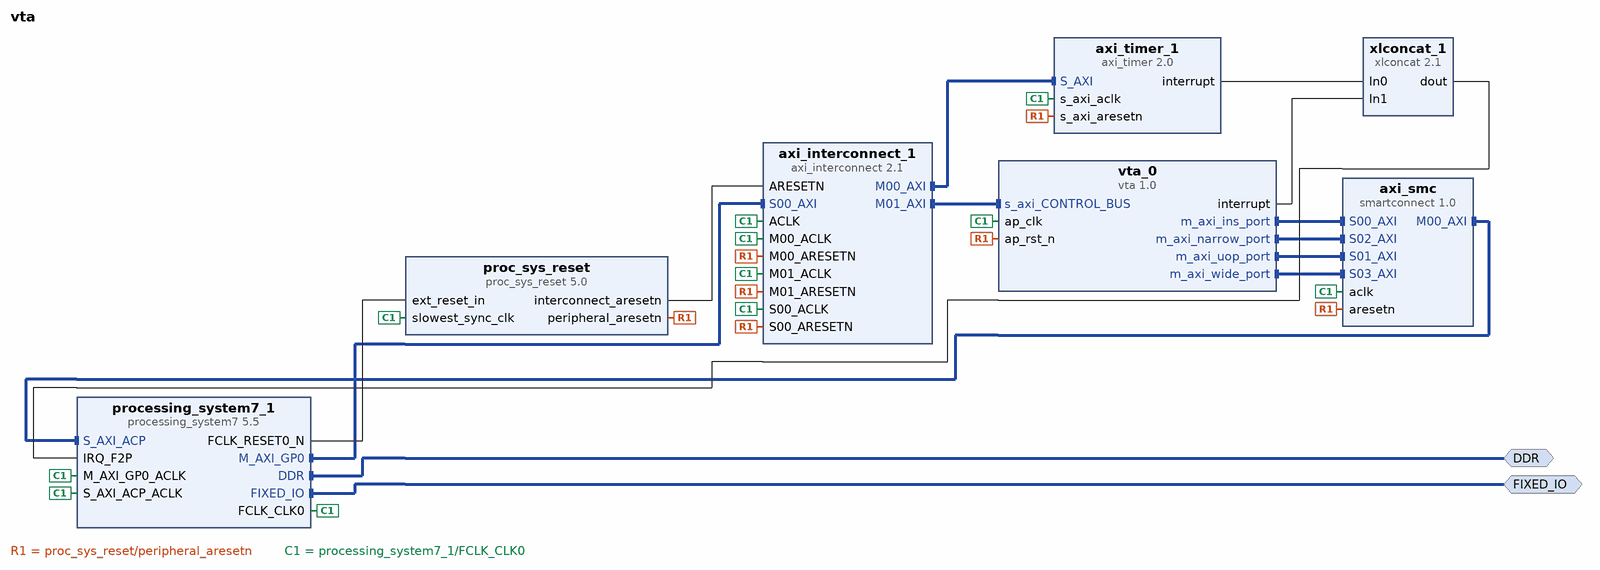
[diagram p0: block diagram of the top level]
# Vivado block design vta, xc7z020clg484-1, Vivado 2017.1
create_bd_design vta

create_bd_intf_port -mode Master -vlnv xilinx.com:interface:ddrx_rtl:1.0 DDR
create_bd_intf_port -mode Master -vlnv xilinx.com:display_processing_system7:fixedio_rtl:1.0 FIXED_IO

create_bd_cell -type ip -vlnv xilinx.com:hls:vta:1.0 vta_0
set_property -dict [list \
  CONFIG.C_M_AXI_INS_PORT_CACHE_VALUE {"1111"} \
  CONFIG.C_M_AXI_UOP_PORT_CACHE_VALUE {"1111"} \
  CONFIG.C_M_AXI_NARROW_PORT_CACHE_VALUE {"1111"} \
  CONFIG.C_M_AXI_WIDE_PORT_CACHE_VALUE {"1111"} \
] [get_bd_cells vta_0]
create_bd_cell -type ip -vlnv xilinx.com:ip:axi_interconnect:2.1 axi_interconnect_1
set_property -dict {CONFIG.NUM_MI 2} [get_bd_cells axi_interconnect_1]
create_bd_cell -type ip -vlnv xilinx.com:ip:smartconnect:1.0 axi_smc
set_property -dict {CONFIG.NUM_SI 4} [get_bd_cells axi_smc]
create_bd_cell -type ip -vlnv xilinx.com:ip:axi_timer:2.0 axi_timer_1
create_bd_cell -type ip -vlnv xilinx.com:ip:proc_sys_reset:5.0 proc_sys_reset
create_bd_cell -type ip -vlnv xilinx.com:ip:processing_system7:5.5 processing_system7_1
set_property -dict [list \
  CONFIG.PCW_FPGA0_PERIPHERAL_FREQMHZ 100 \
  CONFIG.PCW_FPGA1_PERIPHERAL_FREQMHZ 142.86 \
  CONFIG.PCW_FPGA2_PERIPHERAL_FREQMHZ 200 \
  CONFIG.PCW_FPGA3_PERIPHERAL_FREQMHZ 167 \
  CONFIG.PCW_USE_S_AXI_ACP 1 \
  CONFIG.PCW_USE_FABRIC_INTERRUPT 1 \
  CONFIG.PCW_USE_HIGH_OCM 1 \
  CONFIG.PCW_USE_DEFAULT_ACP_USER_VAL 1 \
  CONFIG.PCW_EN_CLK1_PORT 1 \
  CONFIG.PCW_EN_CLK2_PORT 1 \
  CONFIG.PCW_EN_CLK3_PORT 1 \
  CONFIG.PCW_IRQ_F2P_INTR 1 \
  CONFIG.PCW_QSPI_PERIPHERAL_ENABLE 0 \
  CONFIG.PCW_ENET0_PERIPHERAL_ENABLE 0 \
  CONFIG.PCW_SD0_PERIPHERAL_ENABLE 0 \
  CONFIG.PCW_USB0_PERIPHERAL_ENABLE 0 \
  CONFIG.PCW_GPIO_MIO_GPIO_ENABLE 0 \
  CONFIG.preset ZC702 \
] [get_bd_cells processing_system7_1]
# 8 more settings of processing_system7_1 are not shown: defaults, MIO pin electricals, DDR timing, and values the tool derives
create_bd_cell -type ip -vlnv xilinx.com:ip:xlconcat:2.1 xlconcat_1
set_property -dict {CONFIG.NUM_PORTS 2} [get_bd_cells xlconcat_1]

# ---- connections ----

connect_bd_intf_net [get_bd_intf_pins vta_0/m_axi_ins_port] [get_bd_intf_pins axi_smc/S00_AXI]
connect_bd_intf_net [get_bd_intf_pins vta_0/m_axi_narrow_port] [get_bd_intf_pins axi_smc/S02_AXI]
connect_bd_intf_net [get_bd_intf_pins vta_0/m_axi_uop_port] [get_bd_intf_pins axi_smc/S01_AXI]
connect_bd_intf_net [get_bd_intf_pins vta_0/m_axi_wide_port] [get_bd_intf_pins axi_smc/S03_AXI]
connect_bd_intf_net [get_bd_intf_pins vta_0/s_axi_CONTROL_BUS] [get_bd_intf_pins axi_interconnect_1/M01_AXI]
connect_bd_intf_net [get_bd_intf_pins axi_smc/M00_AXI] [get_bd_intf_pins processing_system7_1/S_AXI_ACP]
connect_bd_intf_net [get_bd_intf_pins axi_interconnect_1/M00_AXI] [get_bd_intf_pins axi_timer_1/S_AXI]
connect_bd_intf_net [get_bd_intf_pins axi_interconnect_1/S00_AXI] [get_bd_intf_pins processing_system7_1/M_AXI_GP0]
connect_bd_intf_net [get_bd_intf_ports DDR] [get_bd_intf_pins processing_system7_1/DDR]
connect_bd_intf_net [get_bd_intf_ports FIXED_IO] [get_bd_intf_pins processing_system7_1/FIXED_IO]
connect_bd_net [get_bd_pins vta_0/interrupt] [get_bd_pins xlconcat_1/In1]
connect_bd_net [get_bd_pins axi_timer_1/interrupt] [get_bd_pins xlconcat_1/In0]
connect_bd_net [get_bd_pins proc_sys_reset/interconnect_aresetn] [get_bd_pins axi_interconnect_1/ARESETN]
connect_bd_net [get_bd_pins proc_sys_reset/peripheral_aresetn] \
  [get_bd_pins vta_0/ap_rst_n] [get_bd_pins axi_interconnect_1/M00_ARESETN] [get_bd_pins axi_interconnect_1/M01_ARESETN] \
  [get_bd_pins axi_interconnect_1/S00_ARESETN] [get_bd_pins axi_smc/aresetn] [get_bd_pins axi_timer_1/s_axi_aresetn]
connect_bd_net [get_bd_pins processing_system7_1/FCLK_CLK0] \
  [get_bd_pins vta_0/ap_clk] [get_bd_pins axi_interconnect_1/ACLK] [get_bd_pins axi_interconnect_1/M00_ACLK] \
  [get_bd_pins axi_interconnect_1/M01_ACLK] [get_bd_pins axi_interconnect_1/S00_ACLK] [get_bd_pins axi_smc/aclk] \
  [get_bd_pins axi_timer_1/s_axi_aclk] [get_bd_pins proc_sys_reset/slowest_sync_clk] \
  [get_bd_pins processing_system7_1/M_AXI_GP0_ACLK] [get_bd_pins processing_system7_1/S_AXI_ACP_ACLK]
connect_bd_net [get_bd_pins processing_system7_1/FCLK_RESET0_N] [get_bd_pins proc_sys_reset/ext_reset_in]
connect_bd_net [get_bd_pins xlconcat_1/dout] [get_bd_pins processing_system7_1/IRQ_F2P]

# ---- address map ----
assign_bd_address -offset 0x42800000 -range 64K -target_address_space [get_bd_addr_spaces processing_system7_1/Data] [get_bd_addr_segs axi_timer_1/S_AXI/Reg]
assign_bd_address -offset 0x43C00000 -range 64K -target_address_space [get_bd_addr_spaces processing_system7_1/Data] [get_bd_addr_segs vta_0/s_axi_CONTROL_BUS/Reg]
assign_bd_address -offset 0x00000000 -range 1G -target_address_space [get_bd_addr_spaces vta_0/Data_m_axi_ins_port] [get_bd_addr_segs processing_system7_1/S_AXI_ACP/ACP_DDR_LOWOCM]
assign_bd_address -offset 0x40000000 -range 1G -target_address_space [get_bd_addr_spaces vta_0/Data_m_axi_ins_port] [get_bd_addr_segs processing_system7_1/S_AXI_ACP/ACP_M_AXI_GP0]
assign_bd_address -offset 0xE0000000 -range 4M -target_address_space [get_bd_addr_spaces vta_0/Data_m_axi_ins_port] [get_bd_addr_segs processing_system7_1/S_AXI_ACP/ACP_IOP]
assign_bd_address -offset 0xFFFC0000 -range 256K -target_address_space [get_bd_addr_spaces vta_0/Data_m_axi_ins_port] [get_bd_addr_segs processing_system7_1/S_AXI_ACP/ACP_HIGH_OCM]
assign_bd_address -offset 0x00000000 -range 1G -target_address_space [get_bd_addr_spaces vta_0/Data_m_axi_narrow_port] [get_bd_addr_segs processing_system7_1/S_AXI_ACP/ACP_DDR_LOWOCM]
assign_bd_address -offset 0x40000000 -range 1G -target_address_space [get_bd_addr_spaces vta_0/Data_m_axi_narrow_port] [get_bd_addr_segs processing_system7_1/S_AXI_ACP/ACP_M_AXI_GP0]
assign_bd_address -offset 0xE0000000 -range 4M -target_address_space [get_bd_addr_spaces vta_0/Data_m_axi_narrow_port] [get_bd_addr_segs processing_system7_1/S_AXI_ACP/ACP_IOP]
assign_bd_address -offset 0xFFFC0000 -range 256K -target_address_space [get_bd_addr_spaces vta_0/Data_m_axi_narrow_port] [get_bd_addr_segs processing_system7_1/S_AXI_ACP/ACP_HIGH_OCM]
assign_bd_address -offset 0x00000000 -range 1G -target_address_space [get_bd_addr_spaces vta_0/Data_m_axi_uop_port] [get_bd_addr_segs processing_system7_1/S_AXI_ACP/ACP_DDR_LOWOCM]
assign_bd_address -offset 0x40000000 -range 1G -target_address_space [get_bd_addr_spaces vta_0/Data_m_axi_uop_port] [get_bd_addr_segs processing_system7_1/S_AXI_ACP/ACP_M_AXI_GP0]
assign_bd_address -offset 0xE0000000 -range 4M -target_address_space [get_bd_addr_spaces vta_0/Data_m_axi_uop_port] [get_bd_addr_segs processing_system7_1/S_AXI_ACP/ACP_IOP]
assign_bd_address -offset 0xFFFC0000 -range 256K -target_address_space [get_bd_addr_spaces vta_0/Data_m_axi_uop_port] [get_bd_addr_segs processing_system7_1/S_AXI_ACP/ACP_HIGH_OCM]
assign_bd_address -offset 0x00000000 -range 1G -target_address_space [get_bd_addr_spaces vta_0/Data_m_axi_wide_port] [get_bd_addr_segs processing_system7_1/S_AXI_ACP/ACP_DDR_LOWOCM]
assign_bd_address -offset 0x40000000 -range 1G -target_address_space [get_bd_addr_spaces vta_0/Data_m_axi_wide_port] [get_bd_addr_segs processing_system7_1/S_AXI_ACP/ACP_M_AXI_GP0]
assign_bd_address -offset 0xE0000000 -range 4M -target_address_space [get_bd_addr_spaces vta_0/Data_m_axi_wide_port] [get_bd_addr_segs processing_system7_1/S_AXI_ACP/ACP_IOP]
assign_bd_address -offset 0xFFFC0000 -range 256K -target_address_space [get_bd_addr_spaces vta_0/Data_m_axi_wide_port] [get_bd_addr_segs processing_system7_1/S_AXI_ACP/ACP_HIGH_OCM]

validate_bd_design
save_bd_design
